# EAGLE design plotter_control (EAGLE 6.5.0)
stepper conroller with 2 counting bits for unipolar stepper motor
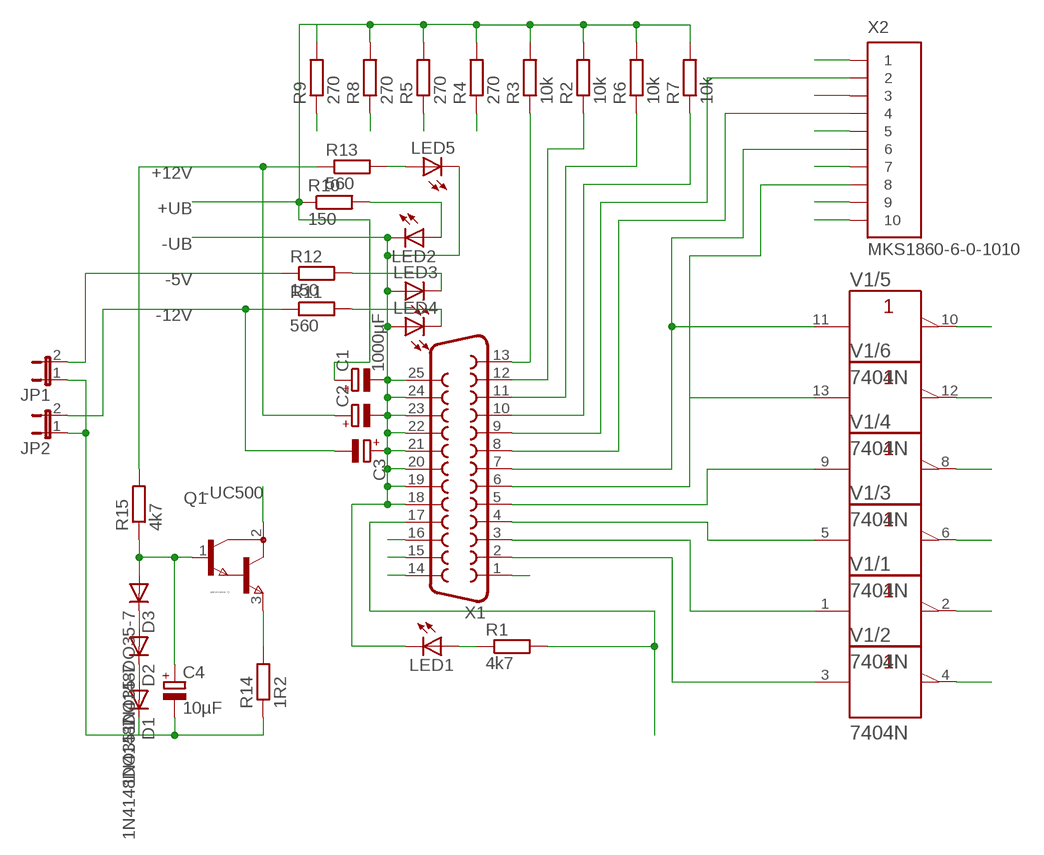
[diagram p0: schematic, sheet 1]

## Parts
C1  1000µF  CPOL-EUE5-8.5  [E5-8,5]
C2  CPOL-EUE5-8.5  [E5-8,5]
C3  CPOL-EUE5-8.5  [E5-8,5]
C4  10µF  CPOL-EUE2.5-5  [E2,5-5]
D1  1N4148DO35-7  [DO35-7]
D2  1N4148DO35-7  [DO35-7]
D3  1N4148DO35-7  [DO35-7]
JP1  JP1E  [JP1]
JP2  JP1E  [JP1]
LED1  LED3MM  [LED3MM]
LED2  LED3MM  [LED3MM]
LED3  LED3MM  [LED3MM]
LED4  LED3MM  [LED3MM]
LED5  LED3MM  [LED3MM]
Q1  BD647  [TO220]
R1  4k7  R-EU_0204/7  [0204/7]
R2  10k  R-EU_0204/7  [0204/7]
R3  10k  R-EU_0204/7  [0204/7]
R4  270  R-EU_0204/7  [0204/7]
R5  270  R-EU_0204/7  [0204/7]
R6  10k  R-EU_0204/7  [0204/7]
R7  10k  R-EU_0204/7  [0204/7]
R8  270  R-EU_0204/7  [0204/7]
R9  270  R-EU_0204/7  [0204/7]
R10  150  R-EU_0207/15  [0207/15]
R11  560  R-EU_0204/7  [0204/7]
R12  150  R-EU_0207/10  [0207/10]
R13  560  R-EU_0204/7  [0204/7]
R14  1R2  R-EU_0204/7  [0204/7]
R15  4k7  R-EU_0204/7  [0204/7]
V1  7404N  [DIL14]
X1  F25HP  [F25HP]
X2  MKS1860-6-0-1010  [MKS1860-6-0-1010]

## Nets
+12V: C2.+ R13.1 R15.2
+UB: C1.+ R2.2 R3.2 R4.2 R5.2 R6.2 R7.2 R8.2 R9.2 R10.1
-5V: JP1.2 R12.1
-12V: C3.- JP2.2 R11.1
-UB: C1.- C2.- C3.+ LED1.K(C) LED2.K(C) LED3.A LED4.A LED5.K(C) X1.18 X1.19 X1.20 X1.21 X1.22 X1.23 X1.24 X1.25 X2.1 X2.10
-UC500: Q1.2(C)
-USERVO: C4.- D1.C JP1.1 JP2.1 R14.1
BIT7: X1.8 X2.4
BIT8: X1.9 X2.2
BOTTOM_END: R3.1 X1.13
BOTTOM_LED: R4.1
ENABLE_MOTOR: R1.2 X1.17
ERROR: X1.15
INIT_PRINTER: X1.16
LEFT_END: R7.1 X1.10
LEFT_LED: R9.1
M1_1+: V1.3(/2:A) X1.2
M1_1-: V1.4(/2:Y)
M1_2+: V1.1(/1:A) X1.3
M1_2-: V1.2(/1:Y)
M2_1+: V1.5(/3:A) X1.4
M2_1-: V1.6(/3:Y)
M2_2+: V1.9(/4:A) X1.5
M2_2-: V1.8(/4:Y)
M3_1+: V1.13(/6:A) X1.6 X2.8
M3_1-: V1.12(/6:Y)
M3_2+: V1.11(/5:A) X1.7 X2.6
M3_2-: V1.10(/5:Y)
M4_1: X2.9
M4_2: X2.7
M4_3: X2.5
M4_4: X2.3
MOTOR_COIL1: X1.1
MOTOR_COIL2: X1.14
N$1: LED1.A R1.1
N$3: LED2.A R10.2
N$4: LED5.A R13.2
N$5: LED3.K(C) R12.2
N$6: LED4.K(C) R11.2
N$7: D1.A D2.C
N$8: D2.A D3.C
N$10: Q1.3(E) R14.2
N$11: C4.+ D3.A Q1.1(B) R15.1
RIGHT_END: R6.1 X1.11
RIGHT_LED: R8.1
TOP_END: R2.1 X1.12
TOP_LED: R5.1

## Power pins joined to a net without a drawn wire
+UB: V1.14(/+UB:+UB)
-UB: V1.7(/-UB:-UB)

## Library data of the parts
C1-C4 = rcl:CPOL-EU: POLARIZED CAPACITOR, European symbol
D1-D3 = diode:1N4148: DIODE high speed (Philips)
JP1 JP2 = jumper:JP1E: JUMPER
LED1-LED5 = led:LED: LED OSRAM: - CHIPLED LG R971, LG N971, LY N971, LG Q971, LY Q971, LO R971, LY R971 LH N974, LH R974 LS Q976, LO Q976, LY Q976 LO Q996 - Hyper CHIPLED LW Q18S LB Q993, LB Q99A, LB R99A - SideLED LS A670, LO A670, LY A670, LG A670, LP A670 LB A673, LV A673, LT A673, LW A673 LH A674 LY A675 LS A676, LA A676, LO A676, LY A676, LW A676 LS A679, LY A679, LG A679 - Hyper Micro SIDELED® LS Y876, LA Y876, LO Y876, LY Y876 LT Y87S - SmartLED LW L88C, LW L88S LB L89C, LB L89S, LG L890 LS L89K, LO L89K, LY L89K LS L896, LA L896, LO L896, LY L896 - TOPLED LS T670, LO T670, LY T670, LG T670, LP T670 LSG T670, LSP T670, LSY T670, LOP T670, LYG T670 LG T671, LOG T671, LSG T671 LB T673, LV T673, LT T673, LW T673 LH T674 LS T676, LA T676, LO T676, LY T676, LB T676, LH T676, LSB T676, LW T676 LB T67C, LV T67C, LT T67C, LS T67K, LO T67K, LY T67K, LW E67C LS E67B, LA E67B, LO E67B, LY E67B, LB E67C, LV E67C, LT E67C LW T67C LS T679, LY T679, LG T679 LS T770, LO T770, LY T770, LG T770, LP T770 LB T773, LV T773, LT T773, LW T773 LH T774 LS E675, LA E675, LY E675, LS T675 LS T776, LA T776, LO T776, LY T776, LB T776 LHGB T686 LT T68C, LB T68C - Hyper Mini TOPLED® LB M676 - Mini TOPLED Santana® LG M470 LS M47K, LO M47K, LY M47K Source: http://www.osram.convergy.de LUXEON: - LUMILED® LXK2-PW12-R00, LXK2-PW12-S00, LXK2-PW14-U00, LXK2-PW14-V00 LXK2-PM12-R00, LXK2-PM12-S00, LXK2-PM14-U00 LXK2-PE12-Q00, LXK2-PE12-R00, LXK2-PE12-S00, LXK2-PE14-T00, LXK2-PE14-U00 LXK2-PB12-K00, LXK2-PB12-L00, LXK2-PB12-M00, LXK2-PB14-N00, LXK2-PB14-P00, LXK2-PB14-Q00 LXK2-PR12-L00, LXK2-PR12-M00, LXK2-PR14-Q00, LXK2-PR14-R00 LXK2-PD12-Q00, LXK2-PD12-R00, LXK2-PD12-S00 LXK2-PH12-R00, LXK2-PH12-S00 LXK2-PL12-P00, LXK2-PL12-Q00, LXK2-PL12-R00 Source: www.luxeon.com KINGBRIGHT: KA-3528ASYC Source: www.kingbright.com
Q1 = NPN:BD647
R1-R15 = rcl:R-EU_: RESISTOR, European symbol
V1 = 74ttl-din:74*04: Hex INVERTER
X1 = con-subd:F25: SUB-D; OC_FARNELL: unknown; OC_NEWARK: unknown
X2 = con-stocko:MKS1860-6-0-1010: Serie MKS 1850 Lötstifte In-line, Raster 2.5 mm, Stiftwannen, stehend, mit Rastlasche Source: http://www.stocko.de/de/index.php?seite=ka_rfk2_mks1850.html&rubrik=Katalog+-+RFK+2 rfk_1850.pdf; OC_FARNELL: unknown; OC_NEWARK: unknown

## Board
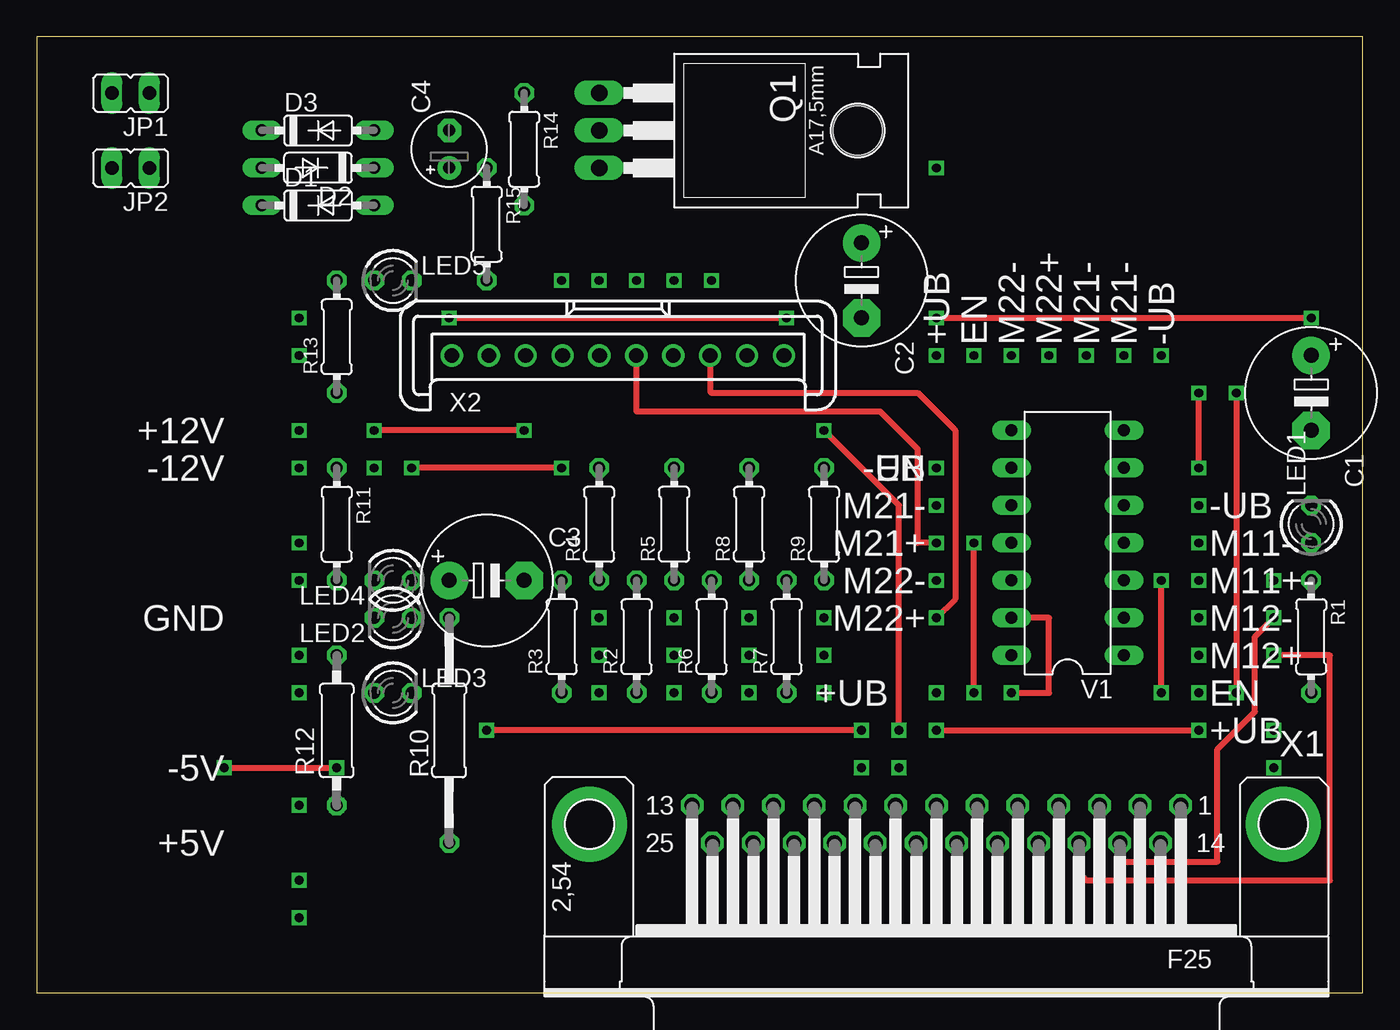
[diagram p1: board, top side]
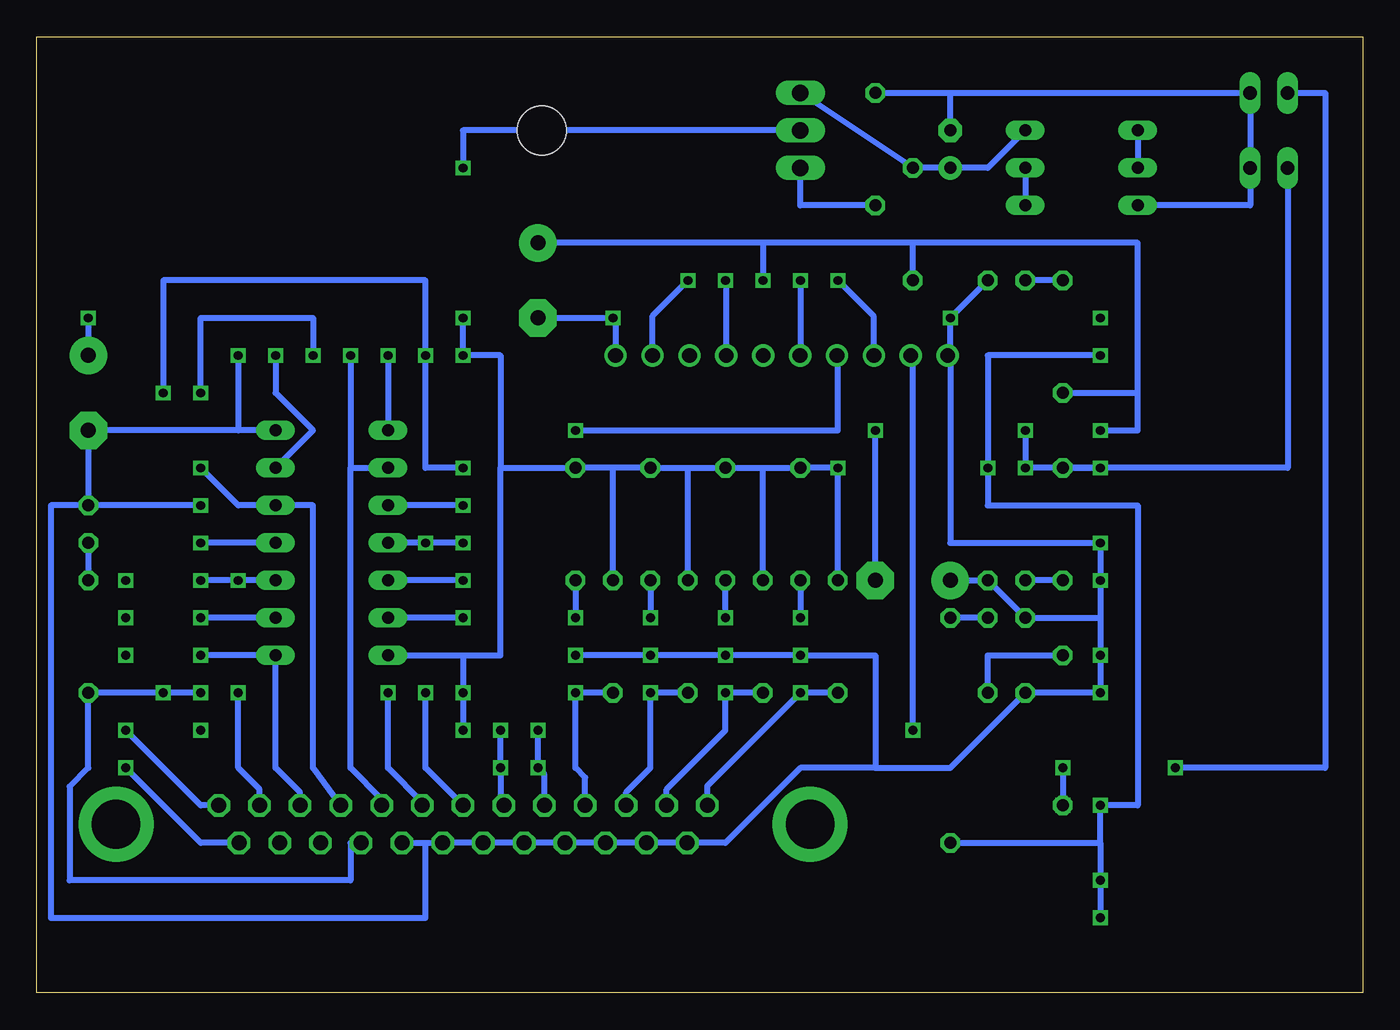
[diagram p2: board, bottom side, seen from below]

Size 89.84 x 64.76 mm. Coordinates in mm from the lower left corner, seen from the top.
Outline: 0,0 89.84,0 89.84,64.76 0,64.76 0,0
Copper layers (1*16): Top 0.035mm / dielectric 1.5mm / Bottom 0.035mm
Design rules "default": minimum track width 10mil, minimum drill 24mil, track to track 8mil, track to pad 8mil, pad to pad 8mil, via to via 8mil, smd to smd 8mil, copper to edge 40mil, drill to drill 8mil, minimum pad ring 10mil, minimum via ring 8mil, stop-mask expansion 4mil, vias tented up to drill 0mil, thermal gap 10mil

### Footprints (pad centres in the part's own frame; a part is rotated, then mirrored left to right if it is on the bottom)
E5-8,5 = drill 1.016 pad 2.54: + -2.54,0 | drill 1.016 pad 2.54 octagon: - 2.54,0
E2,5-5 = drill 0.813 pad 1.6: + -1.27,0 | drill 0.813 pad 1.6 octagon: - 1.27,0
DO35-7 = drill 0.813 long: A 3.81,0; C -3.81,0
JP1 = drill 0.914 long: 1 0,-1.27; 2 0,1.27
LED3MM = drill 0.813 octagon: A -1.27,0; K 1.27,0
TO220 = drill 1.118 pad 1.626 long: 1 -2.54,-6.35; 2 0,-6.35; 3 2.54,-6.35 | hole 3.302: 0,11.176
0204/7 = drill 0.813 octagon: 1 -3.81,0; 2 3.81,0
0207/15 = drill 0.813 octagon: 1 -7.62,0; 2 7.62,0
0207/10 = drill 0.813 octagon: 1 -5.08,0; 2 5.08,0
DIL14 = drill 0.813 long: 1 -7.62,-3.81; 2 -5.08,-3.81; 3 -2.54,-3.81; 4 0,-3.81; 5 2.54,-3.81; 6 5.08,-3.81; 7 7.62,-3.81; 8 7.62,3.81; 9 5.08,3.81; 10 2.54,3.81; 11 0,3.81; 12 -2.54,3.81; 13 -5.08,3.81; 14 -7.62,3.81
F25HP = drill 1.016 octagon: 1 -16.561,-1.27; 2 -13.792,-1.27; 3 -11.049,-1.27; 4 -8.28,-1.27; 5 -5.512,-1.27; 6 -2.769,-1.27; 7 0,-1.27; 8 2.769,-1.27; 9 5.512,-1.27; 10 8.28,-1.27; 11 11.049,-1.27; 12 13.792,-1.27; 13 16.561,-1.27; 14 -15.189,1.27; 15 -12.421,1.27; 16 -9.652,1.27; 17 -6.909,1.27; 18 -4.14,1.27; 19 -1.372,1.27; 20 1.372,1.27; 21 4.14,1.27; 22 6.909,1.27; 23 9.652,1.27; 24 12.421,1.27; 25 15.189,1.27 | drill 3.302 pad 5.08: G1 -23.52,0; G2 23.52,0
MKS1860-6-0-1010 = drill 1 pad 1.422: 1 -11.25,0; 2 -8.75,0; 3 -6.25,0; 4 -3.75,0; 5 -1.25,0; 6 1.25,0; 7 3.75,0; 8 6.25,0; 9 8.75,0; 10 11.25,0

### Placement (x,y rotation side)
C1  86.36,40.64 270 top
C2  55.88,48.26 270 top
C3  30.48,27.94 0 top
C4  27.94,57.15 90 top
D1  19.05,53.34 0 top
D2  19.05,55.88 180 top
D3  19.05,58.42 0 top
JP1  6.35,60.96 90 top
JP2  6.35,55.88 90 top
LED1  86.36,31.75 90 top
LED2  24.13,25.4 180 top
LED3  24.13,20.32 0 top
LED4  24.13,27.94 180 top
LED5  24.13,48.26 0 top
Q1  44.45,58.42 270 top
R1  86.36,24.13 270 top
R2  40.64,24.13 90 top
R3  35.56,24.13 90 top
R4  38.1,31.75 90 top
R5  43.18,31.75 90 top
R6  45.72,24.13 90 top
R7  50.8,24.13 90 top
R8  48.26,31.75 90 top
R9  53.34,31.75 90 top
R10  27.94,17.78 90 top
R11  20.32,31.75 270 top
R12  20.32,17.78 90 top
R13  20.32,44.45 90 top
R14  33.02,57.15 270 top
R15  30.48,52.07 270 top
V1  69.85,30.48 90 top
X1  60.96,11.43 180 top
X2  39.37,43.18 0 top

### Tracks (layer width: path | path; a pad name or v marks a point on that pad's centre or on a via)
+12V  (via drill 0.6)
  Bottom 0.406: v17.78,38.1 15.24,38.1 15.24,40.64 | 30.48,50.8 15.24,50.8 15.24,40.64 | 30.48,50.8 40.64,50.8 | 40.64,50.8 v40.64,48.26 | R13.1 15.24,40.64 | 40.64,50.8 C2.+ | R15.2 30.48,50.8
+UB  (via drill 0.6)
  Top 0.406: v60.96,17.78 v78.74,17.78 | v35.56,35.56 v25.4,35.56 | v60.96,45.72 v86.36,45.72
  Bottom 0.406: V1.14 60.96,22.86 | v60.96,17.78 v60.96,20.32 60.96,22.86 | 58.42,35.56 58.42,43.18 v60.96,43.18 v60.96,45.72 | R3.2 v35.56,35.56 R4.2 40.64,35.56 | R2.2 40.64,35.56 | 40.64,35.56 R5.2 45.72,35.56 | R6.2 45.72,35.56 | 45.72,35.56 R8.2 50.8,35.56 | 50.8,35.56 R9.2 58.42,35.56 | R7.2 50.8,35.56 | 60.96,22.86 58.42,22.86 58.42,35.56 | v17.78,43.18 25.4,43.18 v25.4,35.56 25.4,33.02 15.24,33.02 15.24,12.7 v17.78,12.7 17.78,10.16 | 17.78,10.16 v17.78,7.62 v17.78,5.08 | R10.1 17.78,10.16 | v86.36,45.72 C1.+
-5V  (via drill 0.6)
  Top 0.406: v12.7,15.24 v20.32,15.24
  Bottom 0.406: JP1.2 2.54,60.96 2.54,15.24 v12.7,15.24 | v20.32,15.24 R12.1
  other vias: 20.32,12.7
-12V  (via drill 0.6)
  Top 0.406: v33.02,38.1 v22.86,38.1
  Bottom 0.406: v17.78,35.56 v22.86,35.56 v22.86,38.1 | R11.1 v17.78,35.56 | C3.- v33.02,38.1 | JP2.2 5.08,35.56 v17.78,35.56
-UB  (via drill 0.6)
  Top 0.406: v27.94,45.72 v50.8,45.72
  Bottom 0.406: v78.74,33.02 LED1.K | LED1.K 88.9,33.02 88.9,5.08 63.5,5.08 63.5,10.16 | 63.5,10.16 X1.19 X1.20 X1.21 X1.22 X1.23 X1.24 X1.25 43.18,10.16 38.1,15.24 33.02,15.24 | X1.18 63.5,10.16 | 17.78,25.4 v17.78,27.94 v17.78,30.48 27.94,30.48 27.94,43.18 | 17.78,25.4 v17.78,22.86 v17.78,20.32 LED3.A 27.94,15.24 33.02,15.24 | X2.1 27.94,43.18 | 27.94,43.18 v27.94,45.72 LED5.K | X2.10 50.62,45.72 v50.8,45.72 C2.- | v53.34,22.86 v48.26,22.86 v43.18,22.86 v38.1,22.86 33.02,22.86 33.02,15.24 | 17.78,25.4 LED2.K LED4.A C3.+ | V1.7 76.2,38.1 | 76.2,38.1 C1.- LED1.K | v76.2,43.18 76.2,38.1
-UC500  (via drill 0.6)
  Bottom 0.406: Q1.2 60.96,58.42 v60.96,55.88
-USERVO
  Bottom 0.406: D1.C 7.62,53.34 JP2.1 JP1.1 27.94,60.96 | R14.1 27.94,60.96 | C4.- 27.94,60.96
BIT7  (via drill 0.6)
  Top 0.406: v58.42,17.78 58.42,33.02 v53.34,38.1
  Bottom 0.406: X1.8 58.42,12.7 v58.42,15.24 v58.42,17.78 | v53.34,38.1 35.56,38.1 35.56,43.12 X2.4
BIT8  (via drill 0.6)
  Top 0.406: v55.88,17.78 v30.48,17.78
  Bottom 0.406: X1.9 55.45,14.81 55.88,15.24 v55.88,17.78 | v30.48,17.78 30.48,43.04 X2.2
BOTTOM_END  (via drill 0.6)
  Bottom 0.406: R3.1 v38.1,20.32 44.4,14.02 X1.13
BOTTOM_LED  (via drill 0.6)
  Bottom 0.406: R4.1 v38.1,25.4
ENABLE_MOTOR  (via drill 0.6)
  Top 0.406: v81.28,40.64 v81.28,20.32
  Bottom 0.406: v78.74,20.32 v81.28,20.32 R1.2 86.36,15.24 87.63,13.97 87.63,7.62 68.58,7.62 68.58,10.16 X1.17 | v81.28,40.64 81.28,48.26 63.5,48.26 v63.5,43.18 63.5,35.56 v60.96,35.56
ERROR  (via drill 0.6)
  Top 0.406: X1.15 73.38,9.17 73.66,8.89 80.01,8.89 80.01,16.51 82.55,19.05 82.55,24.13 v83.82,25.4
INIT_PRINTER  (via drill 0.6)
  Top 0.406: X1.16 70.61,8.13 71.12,7.62 87.63,7.62 87.63,22.86 v83.82,22.86
LEFT_END  (via drill 0.6)
  Bottom 0.406: R7.1 v53.34,20.32 53.34,15.24 52.68,14.58 X1.10
LEFT_LED  (via drill 0.6)
  Bottom 0.406: R9.1 v53.34,25.4
M1_1+  (via drill 0.6)
  Top 0.406: v76.2,20.32 v76.2,27.94
  Bottom 0.406: X1.2 74.75,13.79 76.2,15.24 v76.2,20.32 | V1.3 v76.2,27.94 v78.74,27.94
M1_1-  (via drill 0.6)
  Bottom 0.406: V1.4 v78.74,30.48
M1_2+  (via drill 0.6)
  Bottom 0.406: v78.74,22.86 V1.1 73.66,15.24 72.01,13.59 X1.3
M1_2-  (via drill 0.6)
  Bottom 0.406: V1.2 v78.74,25.4
M2_1+  (via drill 0.6)
  Top 0.406: v78.74,35.56 v78.74,40.64
  Bottom 0.406: X1.4 71.12,15.24 71.12,33.02 V1.5 76.2,33.02 v78.74,35.56 | v78.74,40.64 78.74,45.72 71.12,45.72 v71.12,43.18
M2_1-  (via drill 0.6)
  Bottom 0.406: v73.66,43.18 73.66,40.64 71.12,38.1 V1.6
M2_2+  (via drill 0.6)
  Bottom 0.406: v68.58,43.18 68.58,35.56 | 68.58,35.56 V1.9 | X1.5 66.47,13.13 68.58,15.24 68.58,35.56
M2_2-  (via drill 0.6)
  Bottom 0.406: v66.04,43.18 V1.8
M3_1+  (via drill 0.6)
  Top 0.406: v66.04,20.32 68.58,20.32 68.58,25.4 V1.13 | X2.8 45.62,40.74 45.72,40.64 59.69,40.64 62.23,38.1 62.23,26.67 v60.96,25.4
  Bottom 0.406: v60.96,25.4 V1.13 | X1.6 63.73,12.93 66.04,15.24 v66.04,20.32
M3_1-  (via drill 0.6)
  Bottom 0.406: v60.96,27.94 V1.12
M3_2+  (via drill 0.6)
  Top 0.406: v63.5,20.32 v63.5,30.48 | v60.96,30.48 59.69,30.48 59.69,36.83 57.15,39.37 40.64,39.37 40.64,43.16 X2.6
  Bottom 0.406: X1.7 63.5,15.24 v63.5,20.32 | V1.11 v63.5,30.48 v60.96,30.48
M3_2-  (via drill 0.6)
  Bottom 0.406: v60.96,33.02 V1.10
M4_1  (via drill 0.6)
  Bottom 0.406: X2.9 48.12,45.86 v45.72,48.26
M4_2  (via drill 0.6)
  Bottom 0.406: X2.7 43.12,48.2 v43.18,48.26
M4_3  (via drill 0.6)
  Bottom 0.406: v38.1,48.26 38.1,43.2 X2.5
M4_4  (via drill 0.6)
  Bottom 0.406: X2.3 33.12,45.82 v35.56,48.26
MOTOR_COIL1  (via drill 0.6)
  Bottom 0.406: X1.1 78.74,12.7 v83.82,17.78
MOTOR_COIL2  (via drill 0.6)
  Bottom 0.406: X1.14 78.74,10.16 v83.82,15.24
N$1
  Bottom 0.406: LED1.A R1.1
N$2  (via drill 0.6)
  other vias: 55.88,15.24
N$3
  Bottom 0.406: LED2.A R10.2
N$4
  Bottom 0.406: R13.2 LED5.A
N$5
  Bottom 0.406: LED3.K 25.4,22.86 R12.2
N$6
  Bottom 0.406: R11.2 LED4.K
N$7
  Bottom 0.406: D2.C D1.A
N$8
  Bottom 0.406: D3.C D2.A
N$9  (via drill 0.6)
  other vias: 83.82,27.94
N$10
  Bottom 0.406: R14.2 38.1,53.34 Q1.3
N$11
  Bottom 0.406: D3.A 25.4,55.88 C4.+ R15.1 Q1.1
RIGHT_END  (via drill 0.6)
  Bottom 0.406: R6.1 v48.26,20.32 48.26,15.24 49.91,13.59 X1.11
RIGHT_LED  (via drill 0.6)
  Bottom 0.406: R8.1 v48.26,25.4
SP_GUT  (via drill 0.6)
  other vias: 17.78,45.72
TOP_END  (via drill 0.6)
  Bottom 0.406: R2.1 v43.18,20.32 43.18,17.78 47.17,13.79 X1.12
TOP_LED  (via drill 0.6)
  Bottom 0.406: v43.18,25.4 R5.1

### Text on the board
tPlace: +UB | EN | M22- | M22+ | M21- | M21- | -UB | -UB | EN | M21- | -UB | M21+ | M11- | M22- | M11+- | M22+ | M12- | M12+ | +UB | EN | +UB
tNames: +12V | -12V | GND | -5V | +5V